# EAGLE schematic APM_v252_RELEASE (EAGLE 6.3)
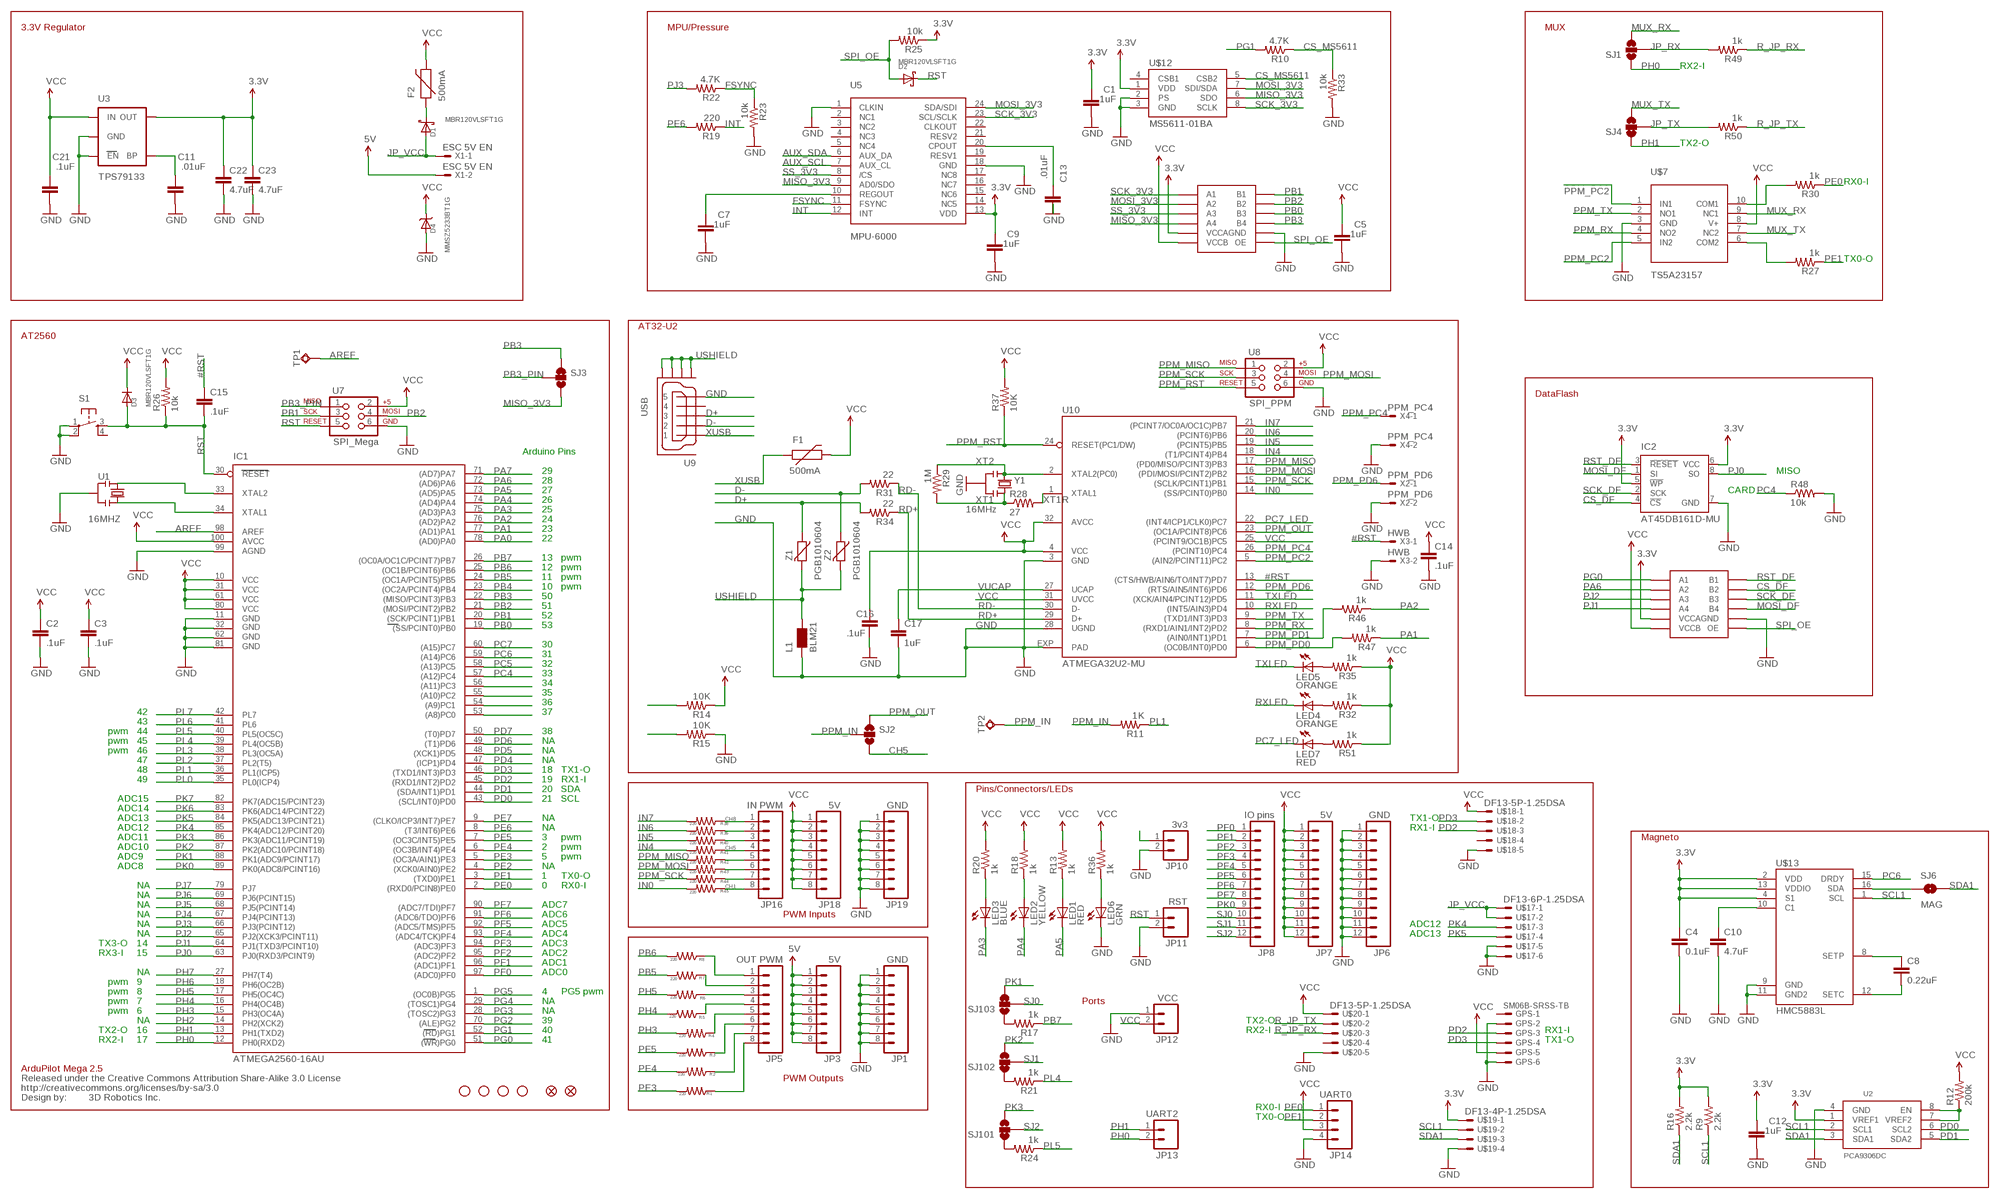
[diagram p0: schematic, sheet 1]

## Parts
C1  .1uF  CAP0402-CAP  [0402-CAP]
C2  .1uF  CAP0402-CAP  [0402-CAP]
C3  .1uF  CAP0402-CAP  [0402-CAP]
C4  0.1uF  CAP0402-CAP  [0402-CAP]
C5  .1uF  CAP0402-CAP  [0402-CAP]
C7  .1uF  CAP0402-CAP  [0402-CAP]
C8  0.22uF  CAP0402-CAP  [0402-CAP]
C9  .1uF  CAP0402-CAP  [0402-CAP]
C10  4.7uF  CAP1206  [1206]
C11  .01uF  CAP0402-CAP  [0402-CAP]
C12  .1uF  CAP0402-CAP  [0402-CAP]
C13  .01uF  CAP0402-CAP  [0402-CAP]
C14  .1uF  CAP0402-CAP  [0402-CAP]
C15  .1uF  CAP0402-CAP  [0402-CAP]
C16  .1uF  CAP0402-CAP  [0402-CAP]
C17  1uF  CAP0402-CAP  [0402-CAP]
C21  .1uF  CAP0402-CAP  [0402-CAP]
C22  4.7uF  CAP0805  [0805]
C23  4.7uF  CAP0805  [0805]
D1  MBR120VLSFT1G  DIODESOD-123  [SOD-123]
D2  MBR120VLSFT1G  DIODESOD-123  [SOD-123]
D3  MBR120VLSFT1G  DIODESOD-123  [SOD-123]
D4  MMSZ5233BT1G  DIODESOD-123  [SOD-123]
F1  500mA  PTCSMD  [PTC-1206]
F2  500mA  PTCSMD  [PTC-1206]
GPS  SM06B-SRSS-TB  [SM06B-SRSS-TB]
IC1  ATMEGA2560-16AU  ATMEGA1280-16AU  [TQFP100]
IC2  AT45DB161D-MU  AT45DB161D-MU-NOPAD  [VDFN-8-NO-BOTTOM-PAD]
JP1  GND  M08  [1X08]
JP2  FIDUCIAL1X2  [FIDUCIAL-1X2]
JP3  5V  M08  [1X08]
JP5  OUT PWM  M08  [1X08]
JP6  GND  M12PTH  [1X12]
JP7  5V  M12PTH  [1X12]
JP8  IO pins  M12PTH  [1X12]
JP10  3v3  M02PTH  [1X02]
JP11  RST  M02PTH  [1X02]
JP12  VCC  M02PTH  [1X02]
JP13  UART2  M02PTH  [1X02]
JP14  UART0  M04PTH  [1X04]
JP16  IN PWM  M08  [1X08]
JP17  FIDUCIAL1X2  [FIDUCIAL-1X2]
JP18  5V  M08  [1X08]
JP19  GND  M08  [1X08]
L1  BLM21  WE-CBF_0805  [0805]
LED1  RED  LED0603  [LED-0603]
LED2  YELLOW  LED0603  [LED-0603]
LED3  BLUE  LED0603  [LED-0603]
LED4  ORANGE  LED0603  [LED-0603]
LED5  ORANGE  LED0603  [LED-0603]
LED6  GRN  LED0603  [LED-0603]
LED7  RED  LED0603  [LED-0603]
R1  220  RESISTOR0402-RES  [0402-RES]
R2  220  RESISTOR0402-RES  [0402-RES]
R3  220  RESISTOR0402-RES  [0402-RES]
R4  220  RESISTOR0402-RES  [0402-RES]
R5  220  RESISTOR0402-RES  [0402-RES]
R6  220  RESISTOR0402-RES  [0402-RES]
R7  220  RESISTOR0402-RES  [0402-RES]
R8  220  RESISTOR0402-RES  [0402-RES]
R9  2.2k  RESISTOR0402-RES  [0402-RES]
R10  4.7K  RESISTOR0402-RES  [0402-RES]
R11  1K  RESISTOR0402-RES  [0402-RES]
R12  200k  RESISTOR0402-RES  [0402-RES]
R13  1k  RESISTOR0402-RES  [0402-RES]
R14  10K  RESISTOR0402-RES  [0402-RES]
R15  10K  RESISTOR0402-RES  [0402-RES]
R16  2.2k  RESISTOR0402-RES  [0402-RES]
R17  1k  RESISTOR0402-RES  [0402-RES]
R18  1k  RESISTOR0402-RES  [0402-RES]
R19  220  RESISTOR0402-RES  [0402-RES]
R20  1k  RESISTOR0402-RES  [0402-RES]
R21  1k  RESISTOR0402-RES  [0402-RES]
R22  4.7K  RESISTOR0402-RES  [0402-RES]
R23  10k  RESISTOR0402-RES  [0402-RES]
R24  1k  RESISTOR0402-RES  [0402-RES]
R25  10k  RESISTOR0402-RES  [0402-RES]
R26  10k  RESISTOR0402-RES  [0402-RES]
R27  1k  RESISTOR0402-RES  [0402-RES]
R28  27  RESISTOR0402-RES  [0402-RES]
R29  1M  RESISTOR0402-RES  [0402-RES]
R30  1k  RESISTOR0402-RES  [0402-RES]
R31  22  RESISTOR0402-RES  [0402-RES]
R32  1k  RESISTOR0402-RES  [0402-RES]
R33  10k  RESISTOR0402-RES  [0402-RES]
R34  22  RESISTOR0402-RES  [0402-RES]
R35  1k  RESISTOR0402-RES  [0402-RES]
R36  1k  RESISTOR0402-RES  [0402-RES]
R37  10K  RESISTOR0402-RES  [0402-RES]
R38  220  RESISTOR0402-RES  [0402-RES]
R39  220  RESISTOR0402-RES  [0402-RES]
R40  220  RESISTOR0402-RES  [0402-RES]
R41  220  RESISTOR0402-RES  [0402-RES]
R42  220  RESISTOR0402-RES  [0402-RES]
R43  220  RESISTOR0402-RES  [0402-RES]
R44  220  RESISTOR0402-RES  [0402-RES]
R45  220  RESISTOR0402-RES  [0402-RES]
R46  1k  RESISTOR0402-RES  [0402-RES]
R47  1k  RESISTOR0402-RES  [0402-RES]
R48  10k  RESISTOR0402-RES  [0402-RES]
R49  1k  RESISTOR0402-RES  [0402-RES]
R50  1k  RESISTOR0402-RES  [0402-RES]
R51  1k  RESISTOR0402-RES  [0402-RES]
S1  TAC_SWITCHSMD  [TACTILE_SWITCH_SMD]
SJ1  SOLDERJUMPER_2WAYT  [SJ_2]
SJ2  SOLDERJUMPER_2WAYT  [SJ_2]
SJ3  SOLDERJUMPER_2WAYT  [SJ_2]
SJ4  SOLDERJUMPER_2WAYT  [SJ_2]
SJ6  MAG  SOLDERJUMPERTRACE  [SJ_2S-TRACE]
SJ101  SOLDERJUMPER_2WAYS  [SJ_3]
SJ102  SOLDERJUMPER_2WAYS  [SJ_3]
SJ103  SOLDERJUMPER_2WAYS  [SJ_3]
TP1  TPSQTP10SQ  [TP10SQ]
TP2  TPSQTP10SQ  [TP10SQ]
U1  16MHZ  RESONATORSMD  [RESONATOR-SMD]
U2  PCA9306DC  [VSSOP8]
U3  TPS79133  V_REG_LDOSMD  [SOT23-5]
U5  MPU-6000  MPU-3000  [QFN-24]
U7  SPI_Mega  AVR_SPI_PRG_6NS  [2X3-NS]
U8  SPI_PPM  AVR_SPI_PRG_6NS  [2X3-NS]
U9  USB  MOLEX_MICRO_USB_AB_BOTTOM_MOUNT  [MOLEX_MICRO_USB_AB_BOTTOM_MOUNT]
U10  ATMEGA32U2-MU  ATMEGA8U2-MU  [QFN32]
U$1  STAND-OFF  [STAND-OFF]
U$2  STAND-OFF  [STAND-OFF]
U$4  STAND-OFF  [STAND-OFF]
U$5  STAND-OFF  [STAND-OFF]
U$6  CREATIVE_COMMONS  [CREATIVE_COMMONS]
U$7  TS5A23157  [MSOP10]
U$12  MS5611-01BA  [MS5611-01BA]
U$13  HMC5883L  [LPCC16]
U$14  TXB0104UQFN  [UQFN-12]
U$15  TXB0104UQFN  [UQFN-12]
U$17  DF13-6P-1.25DSA  [DF13-6P-1.25DSA]
U$18  DF13-5P-1.25DSA  [DF13-5P-1.25DSA]
U$19  DF13-4P-1.25DSA  [DF13-4P-1.25DSA]
U$20  DF13-5P-1.25DSA  [DF13-5P-1.25DSA]
X1  ESC 5V EN  87758-0216  [87758-0216]
X2  PPM_PD6  87758-0216  [87758-0216]
X3  HWB  87758-0216  [87758-0216]
X4  PPM_PC4  87758-0216  [87758-0216]
Y1  16MHz  RESONATORMU  [RESONATOR]
Z1  PGB1010604  VARISTORCN0603  [CT/CN0603]
Z2  PGB1010604  VARISTORCN0603  [CT/CN0603]

## Nets
3.3V: C1.2 C4.1 C9.2 C12.2 C22.1 C23.1 IC2.5(!WP) IC2.6(VCC) R9.2 R16.2 R25.1 U2.1(VREF1) U3.5(OUT) U5.13(VDD) U$12.1(VDD) U$13.2(VDD) U$13.4(S1) U$13.13(VDDIO) U$14.1(VCCA) U$15.1(VCCA) U$19.1
5V: JP3.1 JP3.2 JP3.3 JP3.4 JP3.5 JP3.6 JP3.7 JP3.8 X1.2
#RST: C15.1 U10.13((CTS/HWB/AIN6/TO/INT7)PD7) X3.1
AREF: IC1.98(AREF) TP1.TP
AUX_SCL: U5.7(AUX_CL)
AUX_SDA: U5.6(AUX_DA)
CH1: JP16.8 R45.1
CH5: JP16.4 R41.1 SJ2.3
CH8: JP16.1 R38.1
CS_DF: IC2.4(!CS) U$15.9(B2)
CS_MS5611: R10.1 R33.1 U$12.5(CSB2)
D+: R34.2 U9.3 Z1.1
D-: R31.2 U9.2 Z2.1
FSYNC: R22.1 R23.1 U5.11(FSYNC)
GND: C1.1 C2.2 C3.2 C4.2 C5.1 C7.1 C9.1 C10.2 C11.1 C12.1 C13.1 C14.2 C16.2 C17.2 C21.1 C22.2 C23.2 D4.A GPS.2 GPS.6 IC1.11(GND) IC1.32(GND1) IC1.62(GND2) IC1.81(GND3) IC1.99(AGND) IC2.7(GND) JP1.1 JP1.2 JP1.3 JP1.4 JP1.5 JP1.6 JP1.7 JP1.8 JP6.1 JP6.2 JP6.3 JP6.4 JP6.5 JP6.6 JP6.7 JP6.8 JP6.9 JP6.10 JP6.11 JP6.12 JP10.2 JP11.2 JP12.1 JP14.4 JP19.1 JP19.2 JP19.3 JP19.4 JP19.5 JP19.6 JP19.7 JP19.8 L1.1 LED6.C R15.1 R23.2 R33.2 R48.2 S1.1 S1.2 U1.2 U2.4(GND) U3.2(GND) U3.3(EN) U5.1(CLKIN) U5.18(GND) U7.6 U8.6 U9.5 U10.3(GND) U10.28(UGND) U10.EXP(PAD) U$7.3(GND) U$12.2(PS) U$12.3(GND) U$13.9(GND) U$13.11(GND2) U$14.6(GND) U$15.6(GND) U$17.5 U$17.6 U$18.5 U$19.4 U$20.5 X2.2 X3.2 X4.2 Y1.2
HI: IC1.54((A9)PC1) R14.2
IN0: R45.2 U10.14((SS/PCINT0)PB0)
IN4: R41.2 U10.18((T1/PCINT4)PB4)
IN5: R40.2 U10.19((PCINT5)PB5)
IN6: R39.2 U10.20((PCINT6)PB6)
IN7: R38.2 U10.21((PCINT7/OC0A/OC1C)PB7)
INT: R19.1 U5.12(INT)
JP_RX: R49.2 SJ1.2
JP_TX: R50.2 SJ4.2
JP_VCC: D1.A U$17.1 U$17.2 X1.1
LO: IC1.53((A8)PC0) IC1.55((A10)PC2) IC1.56((A11)PC3) R15.2
MISO_3V3: SJ3.3 U5.9(AD0/SDO) U$12.6(SDO) U$14.5(A4)
MOSI_3V3: U5.24(SDA/SDI) U$12.7(SDI/SDA) U$14.3(A2)
MOSI_DF: IC2.1(SI) U$15.7(B4)
MUX_RX: SJ1.3 U$7.9(NC1)
MUX_TX: SJ4.3 U$7.7(NC2)
N$1: LED6.A R36.1
N$2: C13.2 U5.20(CPOUT)
N$3: C7.2 U5.10(REGOUT)
N$4: JP10.1
N$5: D1.C F2.1
N$6: C11.2 U3.4(BP)
N$7: C10.1 U$13.10(C1)
N$8: JP5.5 R4.1
N$9: JP5.6 R3.1
N$10: JP5.7 R2.1
N$11: JP5.8 R1.1
N$12: R12.1 U2.7(VREF2) U2.8(EN)
N$13: JP5.4 R5.1
N$14: JP5.3 R6.1
N$15: JP5.2 R7.1
N$16: JP5.1 R8.1
N$18: LED7.A R51.2
N$19: JP16.2 R39.1
N$20: JP16.3 R40.1
N$22: JP16.5 R42.1
N$23: JP16.6 R43.1
N$24: JP16.7 R44.1
N$25: SJ6.1 U$13.16(SDA)
N$26: C8.1 U$13.8(SETP)
N$27: C8.2 U$13.12(SETC)
N$28: LED1.A R13.1
N$29: LED5.A R35.2
N$30: LED4.A R32.2
N$31: LED2.A R18.1
N$32: R30.2 U$7.10(COM1)
N$33: R27.2 U$7.6(COM2)
N$34: LED3.A R20.1
N$36: R17.2 SJ103.1
N$38: R24.2 SJ101.1
N$39: R21.2 SJ102.1
N$56: IC1.34(XTAL1) U1.3
N$89: IC1.33(XTAL2) U1.1
PA0: IC1.78((AD0)PA0)
PA1: IC1.77((AD1)PA1) R47.1
PA2: IC1.76((AD2)PA2) R46.1
PA3: IC1.75((AD3)PA3) LED3.C
PA4: IC1.74((AD4)PA4) LED2.C
PA5: IC1.73((AD5)PA5) LED1.C
PA6: IC1.72((AD6)PA6) U$15.3(A2)
PA7: IC1.71((AD7)PA7)
PB0: IC1.19((SS/PCINT0)PB0) U$14.8(B3)
PB1: IC1.20((SCK/PCINT1)PB1) U7.3 U$14.10(B1)
PB2: IC1.21((MOSI/PCINT2)PB2) U7.4 U$14.9(B2)
PB3: IC1.22((MISO/PCINT3)PB3) SJ3.1 U$14.7(B4)
PB3_PIN: SJ3.2 U7.1
PB4: IC1.23((OC2A/PCINT4)PB4)
PB5: IC1.24((OC1A/PCINT5)PB5) R7.2
PB6: IC1.25((OC1B/PCINT6)PB6) R8.2
PB7: IC1.26((OC0A/OC1C/PCINT7)PB7) R17.1
PC4: IC1.57((A12)PC4) R48.1
PC5: IC1.58((A13)PC5)
PC6: IC1.59((A14)PC6) U$13.15(DRDY)
PC7: IC1.60((A15)PC7)
PC7_LED: LED7.C U10.22((INT4/ICP1/CLK0)PC7)
PD0: IC1.43((SCL/INT0)PD0) U2.6(SCL2)
PD1: IC1.44((SDA/INT1)PD1) U2.5(SDA2)
PD2: GPS.3 IC1.45((RXD1/INT2)PD2) U$18.3
PD3: GPS.4 IC1.46((TXD1/INT3)PD3) U$18.2
PD4: IC1.47((ICP1)PD4)
PD5: IC1.48((XCK1)PD5)
PD6: IC1.49((T1)PD6)
PD7: IC1.50((T0)PD7)
PE0: IC1.2((RXD0/PCIN8)PE0) JP14.1 R30.1
PE1: IC1.3((TXD0)PE1) JP14.2 R27.1
PE2: IC1.4((XCK0/AIN0)PE2)
PE3: IC1.5((OC3A/AIN1)PE3) R1.2
PE4: IC1.6((OC3B/INT4)PE4) R2.2
PE5: IC1.7((OC3C/INT5)PE5) R3.2
PE6: IC1.8((T3/INT6)PE6) R19.2
PE7: IC1.9((CLKO/ICP3/INT7)PE7)
PF0: IC1.97((ADC0)PF0) JP8.1
PF1: IC1.96((ADC1)PF1) JP8.2
PF2: IC1.95((ADC2)PF2) JP8.3
PF3: IC1.94((ADC3)PF3) JP8.4
PF4: IC1.93((ADC4/TCK)PF4) JP8.5
PF5: IC1.92((ADC5/TMS)PF5) JP8.6
PF6: IC1.91((ADC6/TDO)PF6) JP8.7
PF7: IC1.90((ADC7/TDI)PF7) JP8.8
PG0: IC1.51((WR)PG0) U$15.2(A1)
PG1: IC1.52((RD)PG1) R10.2
PG2: IC1.70((ALE)PG2)
PG3: IC1.28((TOSC2)PG3)
PG4: IC1.29((TOSC1)PG4)
PG5: IC1.1((OC0B)PG5)
PH0: IC1.12(PH0(RXD2)) JP13.2 SJ1.1
PH1: IC1.13(PH1(TXD2)) JP13.1 SJ4.1
PH2: IC1.14(PH2(XCK2))
PH3: IC1.15(PH3(OC4A)) R4.2
PH4: IC1.16(PH4(OC4B)) R5.2
PH5: IC1.17(PH5(OC4C)) R6.2
PH6: IC1.18(PH6(OC2B))
PH7: IC1.27(PH7(T4))
PJ0: IC1.63(PJ0(RXD3/PCINT9)) IC2.8(SO)
PJ1: IC1.64(PJ1(TXD3/PCINT10)) U$15.5(A4)
PJ2: IC1.65(PJ2(XCK3/PCINT11)) U$15.4(A3)
PJ3: IC1.66(PJ3(PCINT12)) R22.2
PJ4: IC1.67(PJ4(PCINT13))
PJ5: IC1.68(PJ5(PCINT14))
PJ6: IC1.69(PJ6(PCINT15))
PJ7: IC1.79(PJ7)
PK0: IC1.89(PK0(ADC8/PCINT16)) JP8.9
PK1: IC1.88(PK1(ADC9/PCINT17)) SJ103.3
PK2: IC1.87(PK2(ADC10/PCINT18)) SJ102.3
PK3: IC1.86(PK3(ADC11/PCINT19)) SJ101.3
PK4: IC1.85(PK4(ADC12/PCINT20)) U$17.3
PK5: IC1.84(PK5(ADC13/PCINT21)) U$17.4
PK6: IC1.83(PK6(ADC14/PCINT22))
PK7: IC1.82(PK7(ADC15/PCINT23))
PL0: IC1.35(PL0(ICP4))
PL1: IC1.36(PL1(ICP5)) R11.1
PL2: IC1.37(PL2(T5))
PL3: IC1.38(PL3(OC5A))
PL4: IC1.39(PL4(OC5B)) R21.1
PL5: IC1.40(PL5(OC5C)) R24.1
PL6: IC1.41(PL6)
PL7: IC1.42(PL7)
PPM_IN: R11.2 SJ2.2 TP2.TP
PPM_MISO: R42.2 U8.1 U10.17((PD0/MISO/PCINT3)PB3)
PPM_MOSI: R43.2 U8.4 U10.16((PDI/MOSI/PCINT2)PB2)
PPM_OUT: SJ2.1 U10.23((OC1A/PCINT8)PC6)
PPM_PC2: U10.5((AIN2/PCINT11)PC2) U$7.1(IN1) U$7.5(IN2)
PPM_PC4: U10.26((PCINT10)PC4) X4.1
PPM_PD0: R47.2 U10.6((OC0B/INT0)PD0)
PPM_PD1: R46.2 U10.7((AIN0/INT1)PD1)
PPM_PD6: U10.12((RTS/AIN5/INT6)PD6) X2.1
PPM_RST: R37.1 U8.5 U10.24(RESET(PC1/DW))
PPM_RX: U10.8((RXD1/AIN1/INT2)PD2) U$7.4(NO2)
PPM_SCK: R44.2 U8.3 U10.15((SCLK/PCINT1)PB1)
PPM_TX: U10.9((TXD1/INT3)PD3) U$7.2(NO1)
R_JP_RX: R49.1 U$20.3
R_JP_TX: R50.1 U$20.2
RD+: R34.1 U10.29(D+)
RD-: R31.1 U10.30(D-)
RST: C15.2 D2.C D3.A IC1.30(RESET) JP11.1 R26.1 S1.3 U7.5
RST_DF: IC2.3(!RESET) U$15.10(B1)
RXLED: LED4.C U10.10((INT5/AIN3)PD4)
SCK_3V3: U5.23(SCL/SCLK) U$12.8(SCLK) U$14.2(A1)
SCK_DF: IC2.2(SCK) U$15.8(B3)
SCL1: R9.1 U2.2(SCL1) U$13.1(SCL) U$19.2
SDA1: R16.1 SJ6.2 U2.3(SDA1) U$19.3
SJ0: JP8.10 SJ103.2
SJ1: JP8.11 SJ102.2
SJ2: JP8.12 SJ101.2
SPI_OE: D2.A R25.2 U$14.12(OE) U$15.12(OE)
SS_3V3: U5.8(/CS) U$14.4(A3)
TXLED: LED5.C U10.11((XCK/AIN4/PCINT12)PD5)
USHIELD: L1.2 U9.GND1 U9.GND2 U9.GND3 U9.GND4 Z1.2 Z2.2
VCC: C2.1 C3.1 C5.2 C14.1 C16.1 C21.2 D3.C D4.C F1.2 F2.2 GPS.5 IC1.10(VCC) IC1.31(VCC1) IC1.61(VCC2) IC1.80(VCC3) IC1.100(AVCC) JP7.1 JP7.2 JP7.3 JP7.4 JP7.5 JP7.6 JP7.7 JP7.8 JP7.9 JP7.10 JP7.11 JP7.12 JP12.2 JP14.3 JP18.1 JP18.2 JP18.3 JP18.4 JP18.5 JP18.6 JP18.7 JP18.8 R12.2 R13.2 R14.1 R18.2 R20.2 R26.2 R32.1 R35.1 R36.2 R37.2 R51.1 U3.1(IN) U7.2 U8.2 U10.4(VCC) U10.25((PCINT9/OC1B)PC5) U10.31(UVCC) U10.32(AVCC) U$7.8(V+) U$14.11(VCCB) U$15.11(VCCB) U$18.1 U$20.1
VUCAP: C17.1 U10.27(UCAP)
XT1: R28.1 R29.2 Y1.3
XT1R: R28.2 U10.1(XTAL1)
XT2: R29.1 U10.2(XTAL2(PC0)) Y1.1
XUSB: F1.1 U9.1
Unconnected: GPS.1 S1.4 U5.2(NC1) U5.3(NC2) U5.4(NC3) U5.5(NC4) U5.14(NC5) U5.15(NC6) U5.16(NC7) U5.17(NC8) U5.19(RESV1) U5.21(RESV2) U5.22(CLKOUT) U9.4 U$12.4(CSB1) U$18.4 U$20.4

## Notes on the sheet
- 3.3V Regulator | MPU/Pressure | MUX
- RX2-I
- TX2-O
- RX0-I
- TX0-O
- AT32-U2
- AT2560
- DataFlash
- Arduino Pins
- 29 | MISO
- 28
- 27 | CARD
- 26
- 25
- 24
- 23
- 22
- 13 | pwm
- 12 | pwm
- 11 | pwm
- 10 | pwm
- 50
- 51
- 52
- 53
- 30
- 31
- 32
- 33
- 34
- 35
- 36
- 42 | 37
- 43
- pwm | 44 | 38
- pwm | 45 | NA
- pwm | 46 | NA
- 47 | NA
- 48 | 18 | TX1-O
- 49 | 19 | RX1-I
- 20 | SDA | Pins/Connectors/LEDs
- ADC15 | 21 | SCL
- ADC14
- ADC13 | NA | TX1-O
- ADC12 | NA | RX1-I
- ADC11 | 3 | pwm | Magneto
- ADC10 | 2 | pwm
- ADC9 | 5 | pwm
- ADC8 | NA
- 1 | TX0-O
- NA | 0 | RX0-I
- NA
- NA | ADC7
- NA | ADC6 | PWM Inputs
- NA | ADC5 | ADC12
- NA | ADC4 | ADC13
- TX3-O | 14 | ADC3
- RX3-I | 15 | ADC2
- ADC1
- NA | ADC0
- pwm | 9
- pwm | 8 | 4 | PG5 pwm
- pwm | 7 | NA | Ports
- pwm | 6 | NA
- NA | 39 | TX2-O
- TX2-O | 16 | 40 | RX2-I | RX1-I
- RX2-I | 17 | 41 | TX1-O
- ArduPilot Mega 2.5
- PWM Outputs
- 3D Robotics Inc.
- RX0-I
- TX0-O

## Library data of the parts
C1-C5 C7-C17 C21-C23 = SparkFun:CAP: Capacitor Standard 0603 ceramic capacitor, and 0.1" leaded capacitor.
D1-D4 = adafruit:DIODE: Diode SMADIODE - SMA Surface Mount Package 20V 1A Schottky Diode Digikey: 641-1014-6-ND DO-1N4148 - Through Hole Small Current Diode SOD-123 20V 1 A (.5mV Vf) Schottky Diode - Digikey: MBRX120TPMSCT-ND SOD-323 10V 570mA (.38mV Vf, 3ns) Schottky Diode - Digikey: ZLLS410CT-ND SOD-523 30V 30mA Schottky Diode (RB751S-40TE61) - Digikey: RB751S-40TE61CT-ND SOT23-R/W - SOT23 Package (R = Solder Paste/Reflow Ovens, W = Hand-Soldering) BAT54Film 40V 300mA - Digikey: 497-7162-1-ND
F1 F2 = SparkFun:PTC: Resettable Fuse PTC Resettable Fuse. Spark Fun Electronics SKU : COM-08357
GPS = con-jst2:?M06B-SRSS-TB: Disconnectable Crimp style connector, 1.0mm pitch 6 contacts
IC1 = atmel-2010:ATMEGA*: MICROCONTROLLER 64/128/256 Kbytes FLASH 4 Kbytes EEPROM 8 Kbytes SRAM 86 General Purpose I/O pins 12-channels16-bit PWM 4 x Serial USARTs 16-channels 10-bit A/D
IC2 = 3DRobotics:AT45DB161D: Atmel 16-megabit 2.5V or 2.7V DataFlash The Atmel® AT45DB161D is a 2.5V or 2.7V, serial-interface sequential access Flash memory ideally suited for a wide variety of digital voice-, image-, program code- and data-storage applications. The AT45DB161D supports Atmel RapidS? serial interface for applications requiring very high speed operations.; DATASHEET: http://www.atmel.com/dyn/resources/prod_documents/doc3500.pdf; LINK: http://www.atmel.com/dyn/products/product_card.asp?part_id=3772; MFGPN: AT45DB161D-MU
JP1 JP3 JP5 JP16 JP18 JP19 = SparkFunv2:M08: Header 8 Standard 8-pin 0.1" header. Use with straight break away headers (SKU : PRT-00116), right angle break away headers (PRT-00553), swiss pins (PRT-00743), machine pins (PRT-00117), and female headers (PRT-00115).
JP2 JP17 = SparkFun:FIDUCIAL: Fiducial Alignment Points Various fiducial points for machine vision alignment.
JP6-JP8 = SparkFun:M12: Header 12 Standard 12-pin 0.1" header. Use with straight break away headers (SKU : PRT-00116), right angle break away headers (PRT-00553), swiss pins (PRT-00743), machine pins (PRT-00117), and female headers (PRT-00115).
JP10-JP13 = SparkFun:M02: Header 2 Standard 2-pin 0.1" header. Use with straight break away headers (SKU : PRT-00116), right angle break away headers (PRT-00553), swiss pins (PRT-00743), machine pins (PRT-00117), and female headers (PRT-00115). Molex polarized connector foot print use with SKU : PRT-08233 with associated crimp pins and housings.
JP14 = SparkFun:M04: Header 4 Standard 4-pin 0.1" header. Use with straight break away headers (SKU : PRT-00116), right angle break away headers (PRT-00553), swiss pins (PRT-00743), machine pins (PRT-00117), and female headers (PRT-00115). Molex polarized connector foot print use with SKU : PRT-08231 with associated crimp pins and housings.
L1 = wuerth-elektronik:WE-CBF: SMD EMI Suppression Ferrite Beads - excellent anti-EMI properties - low DCR - impedances till 3000 ohms - rated current up to 6 A
LED1-LED7 = SparkFun:LED: LEDs Standard schematic elements and footprints for 5mm, 3mm, 1206, and 0603 sized LEDs. 5mm - Spark Fun Electronics SKU : COM-00529 (and others)
R1-R51 = SparkFun:RESISTOR: Resistor Basic schematic elements and footprints for 0603, 1206, and PTH resistors.
S1 = DIYdrones3:TAC_SWITCH: Momentary Switch Button commonly used for reset or general input. Spark Fun Electronics SKU : COM-00097
SJ1-SJ4 SJ101-SJ103 = SparkFun:SOLDERJUMPER_2WAY: Solder Jumper 2 way solder jumper
SJ6 = SparkFun:SOLDERJUMPER: Solder Jumper Standard SMD solder jumper. Used to automate production. Two varients : Normally Open and Normally Closed are the same, but have different paste layers. NC will have a large amount of paste and should jumper during reflow.
TP1 TP2 = testpad:TPSQ: Test pad
U1 = DIYdrones3:RESONATOR: Resonator Small SMD resonator. This is the itty bitty 10/20MHz resonators with built in caps. CSTCE10M0G55 and CSTCE20M0V53. Footprint has been reviewed closely but hasn't been tested yet.
U2 = DIYdrones_082610:PCA9306DC
U3 = SparkFun:V_REG_LDO: Voltage Regulator LDO Standard 150mA LDO voltage regulator in SOT-23 layout. Micrel part MIC5205. BP (by-pass) pin is used to lower output noise with 470pF cap.
U5 = 3DRobotics_Master_Library:MPU-3000: Invensense MPU-3000 Motion Processing Unit The MPU-30X0 Motion Processing Unit (MPU?) is the world?s first motion processing solution with integrated 6-axis sensor fusion for smart phone applications. The MPU-30X0 has an embedded 3- axis gyroscope and Digital Motion Processor? (DMP) hardware accelerator engine with a secondary I 2 C port that interfaces to third party digital accelerometers to deliver a complete 6-axis sensor fusion output to its primary I 2 C port. This combines both linear and rotational motion into a single data stream for the application.; DATASHEET: http://invensense.com/mems/gyro/documents/PS-MPU-3000A-00_v2.6.pdf; LINK: http://www.invensense.com/mems/gyro/mpu3000.html; MFGPN: MPU-3000
U7 U8 = SparkFunv2:AVR_SPI_PRG_6: AVR ISP 6 Pin This is the reduced ISP connector for AVR programming. Common on Arduino. This footprint will take up less PCB space and can be used with a 10-pin to 6-pin adapter such as SKU: BOB-08508
U9 = 3DRobotics:MOLEX_MICRO_USB_AB_BOTTOM_MOUNT: Molex Micro USB AB Bottom Mount Receptacle; DATASHEET: http://www.molex.com/pdm_docs/sd/475890001_sd.pdf; LINK: http://www.molex.com/molex/products/datasheet.jsp?part=active/0475890001_IO_CONNECTORS.xml&channel=Products&Lang=en-US; MFGPN: 47589-0001
U10 = atmel:ATMEGA8U2-MU
U$1 U$2 U$4 U$5 = DIYdrones3:STAND-OFF: Stand Off This is the mechanical footprint for a #4 phillips button head screw. Use the keepout ring to avoid running the screw head into surrounding components. SKU : PRT-00447
U$6 = SparkFun:CREATIVE_COMMONS
U$7 = 3DRobotics:TS5A23157: TS5A23157 Dual 10-Ohm SPDT Analog Switch The TS5A23157 is a dual single-pole double-throw (SPDT) analog switch designed to operate from 1.65 V to 5.5 V. This device can handle both digital and analog signals. Signals up to 5.5 V (peak) can be transmitted in either direction.; DATASHEET: http://focus.ti.com/lit/ds/symlink/ts5a23157.pdf; LINK: http://focus.ti.com/docs/prod/folders/print/ts5a23157.html; MFGPN: TS5A23157DGSR
U$12 = 3DRobotics:MS5611-01BA: MS5611-01BA The MS5611-01BA is a new generation of high resolution altimeter sensors from MEAS Switzerland with SPI and I 2 C bus interface. It is optimized for altimeters and variometers with an altitude resolution of 10 cm. The sensor module includes a high linearity pressure sensor and an ultra low power 24 bit ?? ADC with internal factory calibrated coefficients. It provides a precise digital 24 Bit pressure and temperature value and different operation modes that allow the user to optimize for conversion speed and current consumption. A high resolution temperature output allows the implementation of an altimeter/thermometer function without any additional sensor. The MS5611-01BA can be interfaced to virtually any microcontroller. The communication protocol is simple, without the need of programming internal registers in the device. Small dimensions of only 5.0 mm x 3.0 mm and a height of 1.7 mm allow for integration in mobile devices. This new sensor module generation is based on leading MEMS technology and latest benefits from MEAS Switzerland proven experience and know-how in high volume manufacturing of altimeter modules, which have been widely used for over a decade. The sensing principle employed leads to very low hysteresis and high stability of both pressure and temperature signal. High resolution module, 10 cm Fast conversion down to 1 ms Low power, 1 µA (standby < 0.15 µA) QFN package 5.0 x 3.0 x 1.7 mm3 Supply voltage 1.8 to 3.6 V Integrated digital pressure sensor (24 bit ?? ADC) Operating range: 10 to 1200 mbar, -40 to +85 °C I2C and SPI interface up to 20 MHz No external components (Internal oscillator) Excellent long term stability; DATASHEET: http://www.meas-spec.com/downloads/MS5611-01BA01.pdf; LINK: http://www.meas-spec.com/product/t_product.aspx?id=8503#; MFGPN: MS5611-01BA
U$13 = 3DRobotics:HMC5883L: Honeywell HMC5883L 3-axis digital compass IC Successor to the HMC5843.; DATASHEET: http://www.dsscircuits.com/images/datasheets/HMC5883L.pdf; LINK: http://parts.digikey.com/1/parts/2057013-ic-compass-3-axis-i2c-16lcc-smd-hmc5883l-tr.html; MFGPN: HMC5883L-TR
U$14 U$15 = 3DRobotics:TXB0104: TI TXB0104 4-Bit Bidirectional Voltage-Level Translator with Auto Direction Sensing This 4-bit noninverting translator uses two separate configurable power-supply rails. The A port is designed to track VCCA. VCCA accepts any supply voltage from 1.2 V to 3.6 V. The B port is designed to track VCCB. VCCB accepts any supply voltage from 1.65 V to 5.5 V. This allows for universal low-voltage bidirectional translation between any of the 1.2-V, 1.5-V, 1.8-V, 2.5-V, 3.3-V, and 5-V voltage nodes. VCCA should not exceed VCCB.
U$17 = pixhawk2:DF13-6P-1.25?
U$18 U$20 = pixhawk2:DF13-5P-1.25?
U$19 = pixhawk2:DF13-4P-1.25?
X1-X4 = con-molex:87758-0216: 2 Pin - 2mm Dual Row Single Wafer, Vertical T/H HDR Source: http://www.molex.com/pdm_docs/sd/877580616_sd.pdf; MPN: 87758-0216; OC_FARNELL: unknown; OC_NEWARK: 94M1513
Y1 = SmartPrj:RESONATOR
Z1 Z2 = varistor:VARISTOR: VARISTOR

## Net classes
0 default: width 0.178 mm, drill 0.381 mm, clearance 0.178 mm